# Altium schematic sheet Soldeerbout_P4.SchDoc: Soldeerbout
size A4; DrawnBy: Boghe Tim; Revision: 01; SheetNumber: 4; SheetTotal: 5; Number: PXL2022-0001
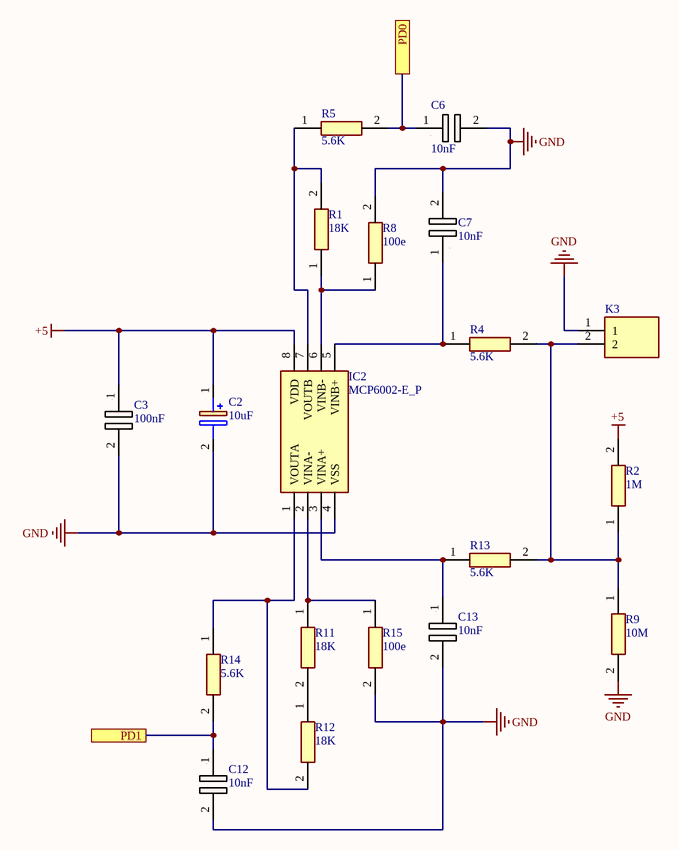
[diagram p0: Soldeerbout_P4.SchDoc]

## Parts
C2  10uF  [C 50V 10µF]
C3  100nF  [0805]
C6  10nF  [0805]
C7  10nF  [0805]
C12  10nF  [0805]
C13  10nF  [0805]
IC2  MCP6002-E_P  [IC2 dual opamp]
K3  TB007-508-02BE  [K printkroonsteen 5.08]  (value not drawn)
R1  18K  [0805]
R2  1M  [0805]
R4  5.6K  [0805]
R5  5.6K  [0805]
R8  100e  [0805]
R9  10M  [0805]
R11  18K  [0805]
R12  18K  [0805]
R13  5.6K  [0805]
R14  5.6K  [0805]
R15  100e  [0805]

## Ports
PD0, PD1

## Nets
+5: C2.1(+) C3.1 IC2.8(VDD) R2.2
GND: C2.2(-) C3.2 C6.2 C7.2 C12.2 C13.2 IC2.4(VSS) K3.1 R8.2 R9.2 R15.2
PD0: C6.1 R5.2 ; port PD0
PD1: C12.1 R14.2 ; port PD1
NetC7_1: C7.1 IC2.5(VINB+) R4.1
NetC13_1: C13.1 IC2.3(VINA+) R13.1
NetIC2_1: IC2.1(VOUTA) R12.2 R14.1
NetIC2_2: IC2.2(VINA-) R11.1 R15.1
NetIC2_6: IC2.6(VINB-) R1.1 R8.1
NetIC2_7: IC2.7(VOUTB) R1.2 R5.1
NetK3_2: K3.2 R2.1 R4.2 R9.1 R13.2
NetR11_2: R11.2 R12.1

## Library data of the parts
C2 = ESS106M050AE2AA: Capacitor Polarised; Manufacturer_Name: Kemet; Datasheet Link: https://content.kemet.com/datasheets/KEM_A4057_ESS.pdf; Height: 8.5mm; Manufacturer_Part_Number: ESS106M050AE2AA
C3 C6 C7 C12 C13 = ESR10EZPJ183_1: Resistor; Manufacturer_Name: ROHM Semiconductor; Datasheet Link: https://datasheet.datasheetarchive.com/originals/distributors/Datasheets_SAMA/30ccb516c688c96e56c83a00b77a93f4.pdf; Height: 0.65mm; Manufacturer_Part_Number: ESR10EZPJ183
IC2 = MCP6002-E_P: Integrated Circuit; Manufacturer_Name: Microchip; Manufacturer_Part_Number: MCP6002-E/P; Datasheet Link: https://componentsearchengine.com//MCP6002-E_P.pdf; Height: 5.334mm; Mouser2 Part Number: 579-MCP6002-E/P; Mouser2 Price/Stock: https://www.mouser.com/Search/Refine.aspx?Keyword=579-MCP6002-E%2FP
K3 = TB007-508-02BE: Connector; Manufacturer_Name: CUI Inc.; Datasheet Link: https://componentsearchengine.com//TB007-508-02BE.pdf; Height: 14mm; Mouser2 Part Number: 490-TB007-508-02BE; Mouser2 Price/Stock: https://www.mouser.com/Search/Refine.aspx?Keyword=490-TB007-508-02BE; Manufacturer_Part_Number: TB007-508-02BE
R1 R2 R4 R5 R8 R9 R11-R15 = ESR10EZPJ183: Resistor; Manufacturer_Name: ROHM Semiconductor; Datasheet Link: https://datasheet.datasheetarchive.com/originals/distributors/Datasheets_SAMA/30ccb516c688c96e56c83a00b77a93f4.pdf; Height: 0.65mm; Manufacturer_Part_Number: ESR10EZPJ183